# EAGLE design Xmas Tree (EAGLE 9.6.2)
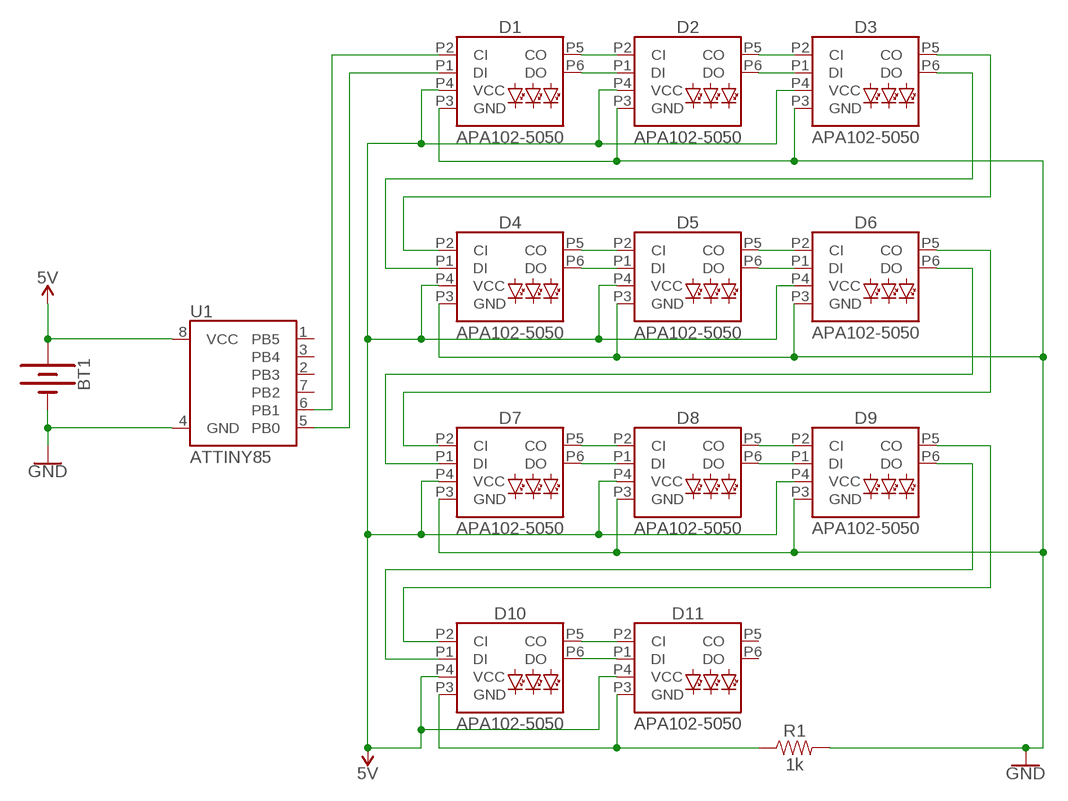
[diagram p0: schematic, sheet 1]

## Parts
BT1  BATTERY-20MM_PTH  [BATTCOM_20MM_PTH]
D1  APA102-5050  [APA102-5050]
D2  APA102-5050  [APA102-5050]
D3  APA102-5050  [APA102-5050]
D4  APA102-5050  [APA102-5050]
D5  APA102-5050  [APA102-5050]
D6  APA102-5050  [APA102-5050]
D7  APA102-5050  [APA102-5050]
D8  APA102-5050  [APA102-5050]
D9  APA102-5050  [APA102-5050]
D10  APA102-5050  [APA102-5050]
D11  APA102-5050  [APA102-5050]
R1  1k  1KOHM-0603-1/10W-1%  [0603]
U1  ATTINY85  [ATTINY85]

## Nets
5V: BT1.1(+) D1.P4(VCC) D2.P4(VCC) D3.P4(VCC) D4.P4(VCC) D5.P4(VCC) D6.P4(VCC) D7.P4(VCC) D8.P4(VCC) D9.P4(VCC) D10.P4(VCC) D11.P4(VCC) U1.8(VCC)
CI1: D1.P2(CI) U1.6(PB1)
CI2: D1.P5(CO) D2.P2(CI)
CI3: D2.P5(CO) D3.P2(CI)
CI4: D3.P5(CO) D4.P2(CI)
CI5: D4.P5(CO) D5.P2(CI)
CI6: D5.P5(CO) D6.P2(CI)
CI7: D6.P5(CO) D7.P2(CI)
CI8: D7.P5(CO) D8.P2(CI)
CI9: D8.P5(CO) D9.P2(CI)
CI10: D9.P5(CO) D10.P2(CI)
CI11: D10.P5(CO) D11.P2(CI)
DI1: D1.P1(DI) U1.5(PB0)
DI2: D1.P6(DO) D2.P1(DI)
DI3: D2.P6(DO) D3.P1(DI)
DI4: D3.P6(DO) D4.P1(DI)
DI5: D4.P6(DO) D5.P1(DI)
DI6: D5.P6(DO) D6.P1(DI)
DI7: D6.P6(DO) D7.P1(DI)
DI8: D7.P6(DO) D8.P1(DI)
DI9: D8.P6(DO) D9.P1(DI)
DI10: D9.P6(DO) D10.P1(DI)
DI11: D10.P6(DO) D11.P1(DI)
GND: BT1.2(-) D1.P3(GND) D2.P3(GND) D3.P3(GND) D4.P3(GND) D5.P3(GND) D6.P3(GND) D7.P3(GND) D8.P3(GND) D9.P3(GND) D10.P3(GND) D11.P3(GND) R1.1 R1.2 U1.4(GND)
Unconnected: D11.P5(CO) D11.P6(DO) U1.1(PB5) U1.2(PB3) U1.3(PB4) U1.7(PB2)

## Library data of the parts
BT1 = SparkFun-Batteries:BATTERY: Battery - Single Cell A variety of battery chemistries, sizes, and footprints. Device List: 20MM_PTH - Coin Cell Battery Holder - 20mm (PTH) <https://www.sparkfun.com/products/783> 20MM_PTH_KIT- Coin Cell battery Holder - 20 mm (PTH) <http://www.sparkfun.com/products/783>kit version with special mask 6.8MM_PTH - Coin Cell Battery Holder - 6.8MM(SMD) <https://www.digikey.com/product-detail/en/seiko-instruments/MS621FE-FL11E/728-1057-ND/1889208?WT.srch=1&gclid=CNOQ5a6LzdQCFZS2wAodXCkE0g> 12MM_SMD - Coin Cell Battery Holder - 12mm (SMD) <https://www.sparkfun.com/products/10592> 12MM_PTH - Coin Cell Battery Holder - 12mm (PTH) <https://www.sparkfun.com/products/7948> 20MM_SMD - 20mm Coin Cell Battery Holder (SMD) (2 legs) Used on the Big Time Watch Kit <https://www.sparkfun.com/products/11734> 20MM_SMD_4LEGS - Coin Cell Battery Holder - 20mm (SMD) <https://www.sparkfun.com/products/11892> 20MM_SMD_4LEGS_OVERPASTE - Coin Cell Battery Holder - 20mm (SMD) <https://www.sparkfun.com/products/11892> (Over-paste on the legs) 24.5MM_PTH - Coin Cell Battery Holder - 24.5mm (PTH) <https://www.sparkfun.com/products/8863> 9V - 9V Battery Holder - PC Mount Used on the SparkFun SparkPunk Sound Kit <https://www.sparkfun.com/products/11177> and SparkFun SparkPunk Sequencer Kit <https://www.sparkfun.com/products/12707> 18650 - Battery Holder - 18650 (PTH) <https://www.sparkfun.com/products/13113> AA - Battery Holder - 1xAA (PTH) <https://www.sparkfun.com/products/7949> AAA - Battery Holder - 1xAAA (PTH) <https://www.sparkfun.com/products/12718> AA_KIT - Battery Holder - 1xAA (PTH) <https://www.sparkfun.com/products/7949> Special kit package - pads only have exposed copper on one side of the board. AAA_KIT - Battery Holder - 1xAAA (PTH) <https://www.sparkfun.com/products/12718> Special kit package - pads only have exposed copper on one side of the board.; PROD_ID: BATT-09031; SF_SKU: PRT-00783
D1-D11 = SparkFun-LED:APA102: APA102 Addressable RGB LED Used in manufacturing of various products at SparkFun Packages: 5050 2020 SparkFun Products: SparkFun Lumenati Boards <https://www.sparkfun.com/categories/405>; PROD_ID: DIO-13739
R1 = SparkFun-Resistors:1KOHM: 1kΩ resistor A resistor is a passive two-terminal electrical component that implements electrical resistance as a circuit element. Resistors act to reduce current flow, and, at the same time, act to lower voltage levels within circuits. - Wikipedia; PROD_ID: RES-07856
U1 = SparkFun-IC-Microcontroller:ATTINY85; PROD_ID: IC-09092

## Board
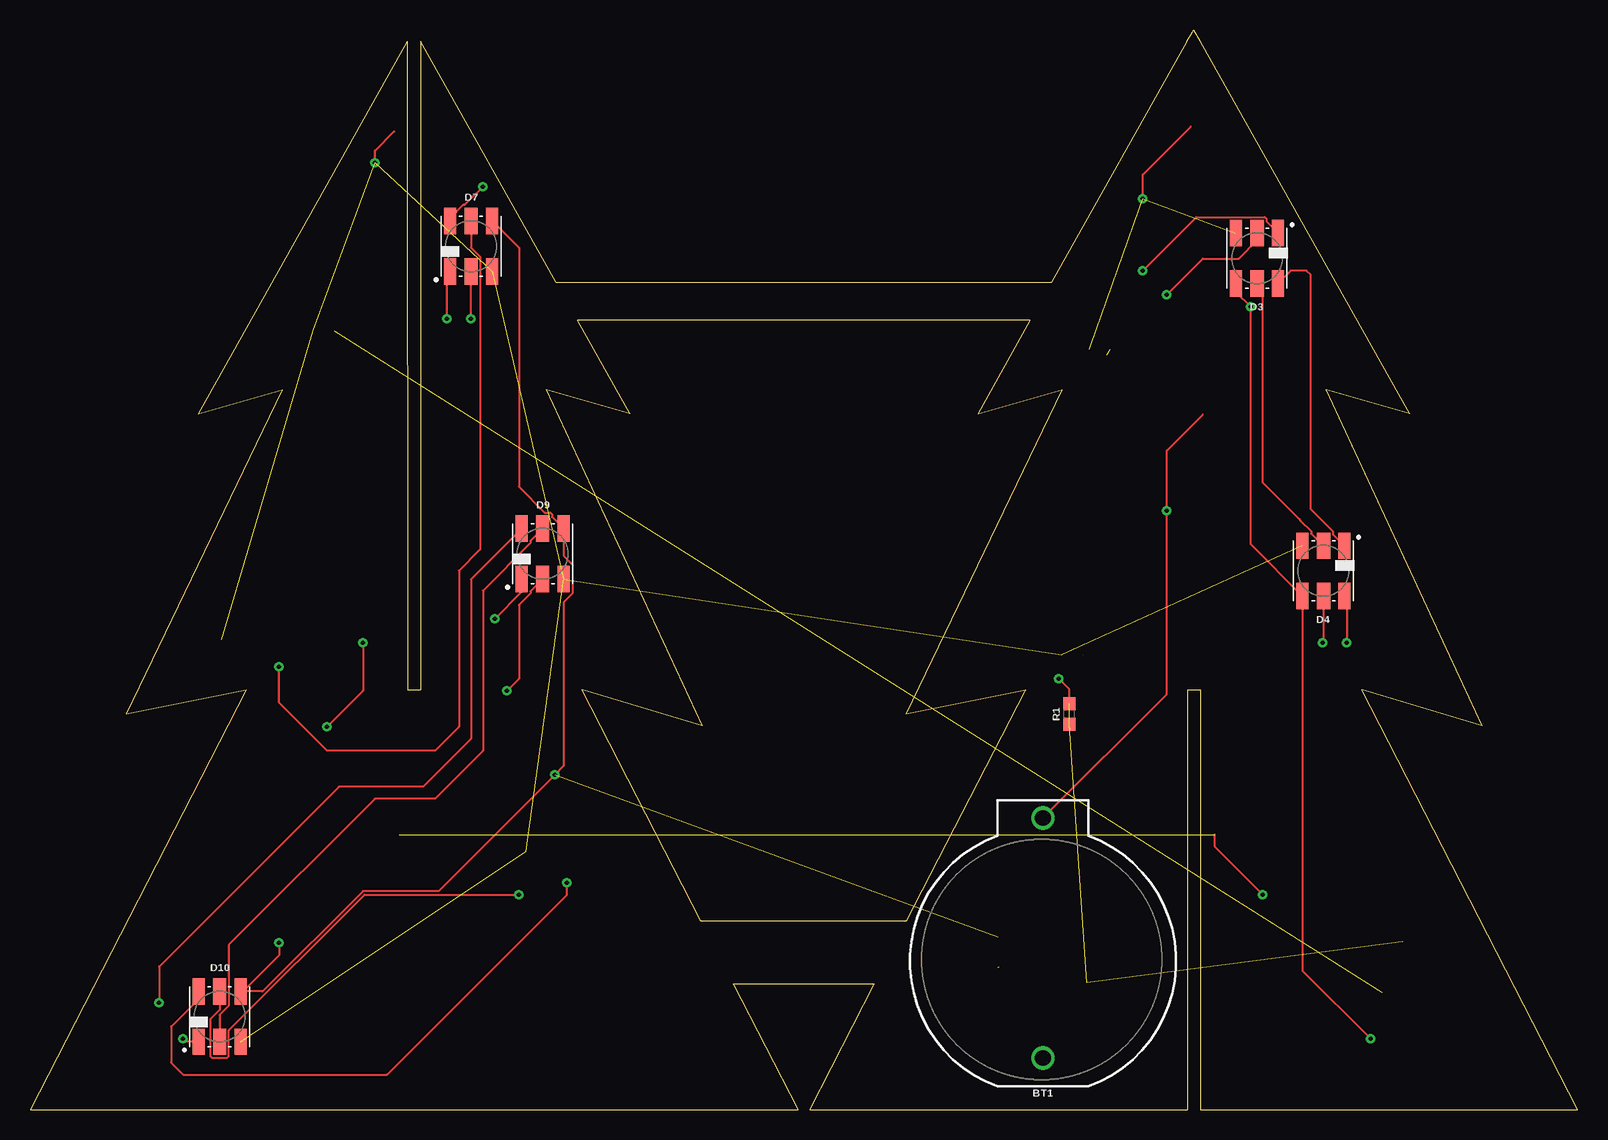
[diagram p1: board, top side]
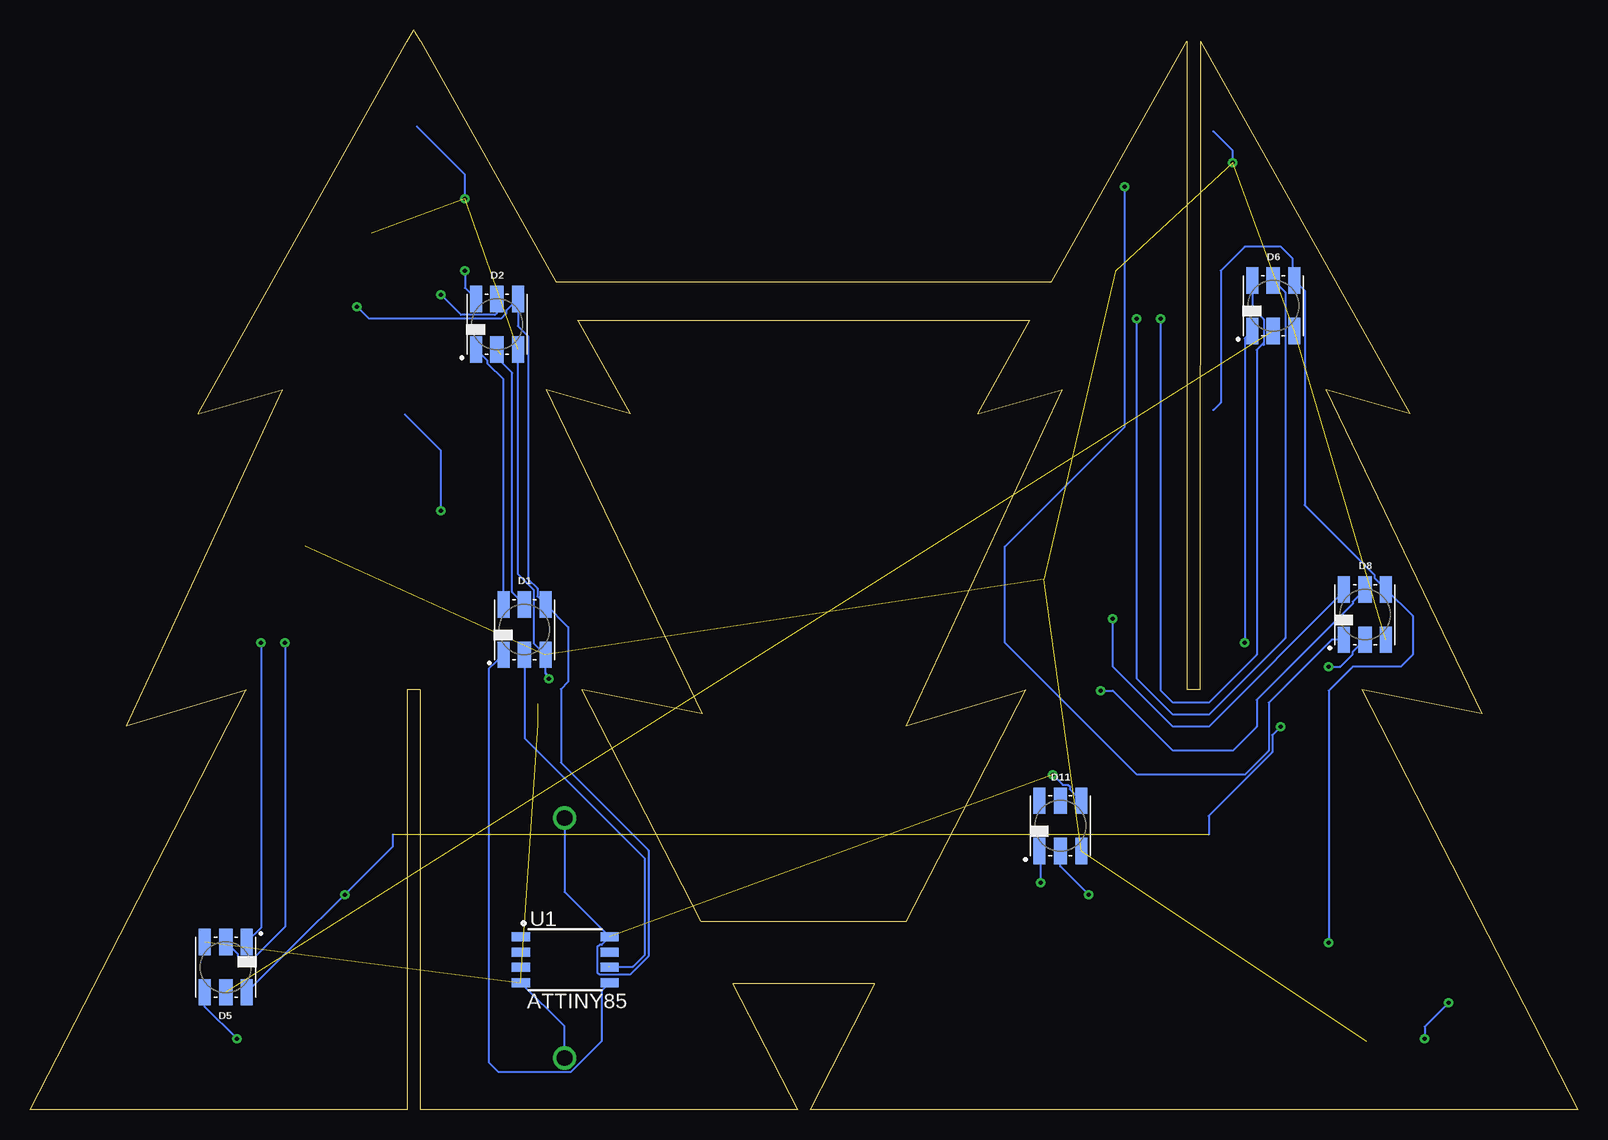
[diagram p2: board, bottom side, seen from below]

Size 129 x 89.96 mm. Coordinates in mm from the lower left corner, seen from the top.
Outline: 14,58 21,60 8,33 18,35 0,0 64,0 58.61,10.48 70.39,10.48 65,0 96.47,0 96.47,0.23 96.48,35 97.55,35 97.57,0.23 97.57,0 129,0 111,35 121,32 108,60 115,58 97.55,89.02 97.02,89.92 96.99,89.96 96.88,89.76 96.45,89.02 85.16,68.95 43.84,68.95 32.55,89.02 32.55,35 31.48,35 31.45,89.02 14,58
Outline: 50,58 43,60 56,32 46,35 55.94,15.67 73.06,15.67 83,35 73,33 86,60 79,58 83.37,65.77 45.63,65.77 50,58
Copper layers (1*16): Top 0.035mm / dielectric 1.5mm / Bottom 0.035mm
Design rules "default": minimum track width 6mil, minimum drill 0.35mm, track to track 6mil, track to pad 6mil, pad to pad 6mil, via to via 6mil, smd to smd 6mil, copper to edge 40mil, drill to drill 6mil, minimum pad ring 10mil, minimum via ring 8mil, stop-mask expansion 4mil, vias tented up to drill 0mil, thermal gap 10mil

### Footprints (pad centres in the part's own frame; a part is rotated, then mirrored left to right if it is on the bottom)
BATTCOM_20MM_PTH = drill 1.3: 1 11.85,0; 2 -8.15,0
APA102-5050 = smd 1 x 2.2: P1 -1.75,-2.1; P3 1.75,-2.1; P4 1.75,2.1; P6 -1.75,2.1 | smd 1.1 x 2.2: P2 0,-2.1; P5 0,2.1
0603 = smd 1.1 x 1: 1 -0.85,0; 2 0.85,0
ATTINY85 = smd 1.524 x 0.762: 1 -3.683,1.905; 2 -3.683,0.635; 3 -3.683,-0.635; 4 -3.683,-1.905; 5 3.727,-1.905; 6 3.727,-0.635; 7 3.727,0.635; 8 3.727,1.905

### Placement (x,y rotation side)
BT1  84.44,12.46 90 top
D1  87.79,40 0 bottom
D2  90.08,65.45 0 bottom
D3  102.29,70.94 180 top
D4  107.83,44.88 180 top
D5  112.67,11.87 180 bottom
D6  25.37,66.99 0 bottom
D7  36.76,71.95 0 top
D8  17.71,41.25 0 bottom
D9  42.74,46.31 0 top
D10  15.8,7.75 0 top
D11  43.11,23.63 0 bottom
R1  86.63,32.96 90 top
U1  84.41,12.48 0 bottom

### Tracks (layer width: path | path; a pad name or v marks a point on that pad's centre or on a via)
5V  (via drill 0.35)  (1 unrouted)
  Top 0.152: v111.75,5.9 106.08,11.57 D4.P4 101.75,47.11 v101.75,66.9 100.54,68.11 D3.P4 | D7.P4 40.75,71.81 40.75,51.9 42.91,49.74 43.38,49.74 43.52,49.6 43.52,49.38 D9.P4 44.49,46.13 45.22,45.41 45.22,43.02 44.49,42.29 44.49,28.64 v43.75,27.9 34.05,18.2 27.75,18.2 19.4,9.85 17.75,9.85 | 17.75,9.85 D10.P4 | v20.75,13.9 20.75,12.85 17.75,9.85 | BT1.1 94.75,34.62 v94.75,49.9 94.75,54.9 97.75,57.9
  Bottom 0.152: v101.75,66.9 100.75,65.9 89.75,65.9 89.75,65.91 89.3,66.36 89.3,66.58 D2.P4 88.33,65.27 87.48,64.43 87.48,44.2 86.71,43.42 86.71,42.77 D1.P4 84.14,40.2 84.14,35.65 84.75,35.04 84.75,28.9 77.44,21.59 77.44,12.77 78.98,11.24 81.54,11.24 81.67,11.37 81.67,13.59 81.54,13.72 81.34,13.72 U1.8 84.44,18.14 BT1.1 | v111.75,5.9 114.42,8.57 D5.P4 | v43.75,27.9 42.91,27.06 42.47,27.06 42.33,26.92 42.33,26.7 D11.P4 | v20.75,13.9 20.75,34.9 18.75,36.9 14.75,36.9 13.75,37.9 13.75,41.14 D8.P4 16.93,44.32 16.93,44.55 22.75,50.36 22.75,68.22 D6.P4 23.75,69.22 23.75,70.9 24.75,71.9 27.75,71.9 29.75,69.9 29.75,58.9 30.37,58.28 | v94.75,49.9 94.75,54.9 97.75,57.9
CI1  (2 unrouted)
  Bottom 0.152: 80.75,11.9 78.75,11.9 77.75,12.9 77.75,20.9 87.75,30.9 87.75,37.9
CI2  (1 unrouted)
  Bottom 0.152: D1.P5 88.81,43.12 88.81,61.39 89.75,62.33 89.75,62.9
CI3  (via drill 0.35)
  Top 0.152: D3.P2 102.29,72.44 100.75,70.9 97.75,70.9 v94.75,67.9
  Bottom 0.152: D2.P5 90.1,67.53 90.1,66.36 90.23,66.22 93.07,66.22 v94.75,67.9
CI4
  Top 0.152: D4.P2 106.81,48 106.81,48.17 105.92,49.07 105.75,49.23 102.75,52.23 102.75,68.38 D3.P5
CI5  (via drill 0.35)
  Top 0.152: D4.P5 107.83,38.98 v107.75,38.9
  Bottom 0.152: D5.P2 111.65,12.95 111.65,12.78 111.52,12.64 110.33,12.64 107.75,15.22 v107.75,38.9
CI6  (1 unrouted)
CI7  (via drill 0.35)
  Top 0.152: v36.75,65.9 D7.P2
  Bottom 0.152: D6.P5 24.37,68.09 24.37,39.28 30.75,32.9 33.75,32.9 36.75,35.9 v36.75,65.9
CI8  (via drill 0.35)
  Top 0.152: D7.P5 36.76,71.82 37.54,71.05 37.54,46.69 35.75,44.9 35.75,31.9 33.75,29.9 24.75,29.9 20.75,33.9 v20.75,36.9
  Bottom 0.152: D8.P2 18.73,38.13 18.73,37.95 19.79,36.9 v20.75,36.9
CI9  (via drill 0.35)
  Top 0.152: D9.P2 41.72,43.19 41.72,43.02 40.75,42.05 40.75,35.9 v39.75,34.9
  Bottom 0.152: v39.75,34.9 38.75,34.9 33.75,29.9 28.75,29.9 26.75,31.9 26.75,34.14 18.73,42.16 18.73,42.33 D8.P5
CI10
  Top 0.152: D9.P5 41.72,47.39 41.72,47.21 37.75,43.25 37.75,29.9 33.75,25.9 28.75,25.9 16.58,13.73 16.58,8.66 15.8,7.88 D10.P2
CI11  (via drill 0.35)
  Top 0.152: D10.P5 15.8,8.31 15.02,7.53 15.02,4.46 15.15,4.32 16.45,4.32 16.58,4.46 16.58,6.6 27.88,17.9 v40.75,17.9
  Bottom 0.152: v40.75,17.9 43.11,20.26 D11.P2
DI1
  Bottom 0.152: U1.5 81.37,9.89 81.37,5.68 83.94,3.11 84.75,3.11 84.94,3.11 89.96,3.11 90.75,3.9 90.75,36.77 D1.P1
DI2
  Bottom 0.152: D2.P1 90.86,62.38 90.86,62.16 89.54,60.84 D1.P6
DI3  (via drill 0.35)
  Top 0.152: D3.P1 103.07,74.01 103.07,74.23 102.94,74.37 97.22,74.37 v92.75,69.9
  Bottom 0.152: v92.75,69.9 92.75,68.47 D2.P6
DI4
  Top 0.152: D4.P1 108.61,47.95 108.61,48.17 106.75,50.03 106.75,69.55 106.4,69.9 105.1,69.9 D3.P6
DI5  (via drill 0.35)
  Top 0.152: D4.P6 109.75,42.61 v109.75,38.9
  Bottom 0.152: v109.75,38.9 109.75,15.14 D5.P1
DI6  (via drill 0.35)  (1 unrouted)
  Top 0.152: v27.75,38.9 27.75,34.9 v24.75,31.9
  Bottom 0.152: D5.P6 98.75,21.94 98.75,22.9 | D6.P1 27.75,64.26 v27.75,38.9 | v24.75,31.9 25.45,31.2 25.45,29.77 30.75,24.47 30.75,22.9
DI7  (via drill 0.35)
  Top 0.152: v34.75,65.9 34.75,69.59 D7.P1
  Bottom 0.152: D6.P6 27.12,66.81 26.15,65.84 26.15,63.9 | 26.15,63.9 26.15,63.7 | 26.15,63.9 26.75,63.3 26.75,37.9 30.75,33.9 33.75,33.9 34.75,34.9 v34.75,65.9
DI8  (via drill 0.35)
  Top 0.152: v37.75,76.9 36.23,75.38 36.12,75.38 35.01,74.27 D7.P6
  Bottom 0.152: D8.P1 20.5,39.15 25.75,33.9 25.75,29.9 27.75,27.9 36.75,27.9 47.75,38.9 47.75,46.9 37.75,56.9 v37.75,76.9
DI9  (via drill 0.35)
  Top 0.152: v38.75,40.9 40.99,43.14 D9.P1
  Bottom 0.152: D8.P6 19.46,43.19 30.75,31.9 33.75,31.9 38.75,36.9 v38.75,40.9
DI10  (via drill 0.35)
  Top 0.152: D9.P6 36.75,44.17 36.75,30.9 32.75,26.9 25.75,26.9 10.75,11.9 v10.75,8.9 | D10.P1 13,5.65 v12.75,5.9
  Bottom 0.152: v10.75,8.9 12.75,6.9 v12.75,5.9
DI11  (via drill 0.35)
  Top 0.152: D10.P6 14.05,9.2 11.75,6.9 11.75,3.9 12.75,2.9 29.75,2.9 44.75,17.9 v44.75,18.9
  Bottom 0.152: v44.75,18.9 44.75,21.42 D11.P1
GND  (via drill 0.35)  (13 unrouted)
  Top 0.152: R1.2 86.63,35.02 v85.75,35.9 | v92.75,75.9 92.75,77.9 96.75,81.9 | v28.75,78.9 28.75,79.9 30.36,81.51
  Bottom 0.152: v85.75,35.9 86.04,36.35 D1.P3 87.01,38.87 87.01,43.3 88.33,44.61 D2.P3 | BT1.2 84.44,6.92 U1.4 | v28.75,78.9 28.75,79.9 30.36,81.51 | v92.75,75.9 92.75,77.9 96.75,81.9
N$1  (via drill 0.35)
  Top 0.152: v102.75,17.9 98.75,21.9 98.75,22.9